# Altium project SHIELD2.PrjPCB
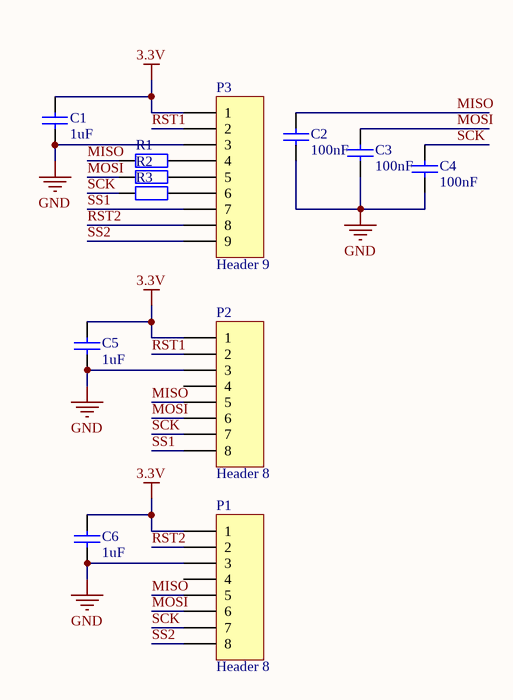
[diagram p0: SHIELD2.SchDoc]
1 sheet, 12 parts. Net scope: global (net labels, ports and power ports of the same name join across sheets).
Board file: PCB2.PcbDoc

## Sheet SHIELD2.SchDoc
size A4

### Parts
C1  value 1uF  [C0805]  (hidden comment: Cap)
C2  value 100nF  [C0805]  (hidden comment: Cap)
C3  value 100nF  [C0805]  (hidden comment: Cap)
C4  value 100nF  [C0805]  (hidden comment: Cap)
C5  value 1uF  [C0805]  (hidden comment: Cap)
C6  value 1uF  [C0805]  (hidden comment: Cap)
P1  Header 8  [HDR1X8]
P2  Header 8  [HDR1X8]
P3  Header 9  [HDR1X9]
R1  Res2  [6-0805_N]  (value not drawn)
R2  Res2  [6-0805_N]  (value not drawn)
R3  Res2  [6-0805_N]  (value not drawn)

### Nets
3.3V: C1.2 C5.2 C6.2 P1.1 P2.1 P3.1
GND: C1.1 C2.1 C3.2 C4.2 C5.1 C6.1 P1.3 P2.3 P3.3
MISO: C2.2 P1.5 P2.5 R1.1
MOSI: C3.1 P1.6 P2.6 R2.1
RST1: P2.2 P3.2
RST2: P1.2 P3.8
SCK: C4.1 P1.7 P2.7 R3.1
SS1: P2.8 P3.7
SS2: P1.8 P3.9
NetP3_4: P3.4 R1.2
NetP3_5: P3.5 R2.2
NetP3_6: P3.6 R3.2

Not connected (* = marked no-connect by the designer): P1 4; P2 4

### Library data of the parts
C1-C6 = Cap: Capacitor; Published: 8-Jun-2000; LatestRevisionDate: 17-Jul-2002; LatestRevisionNote: Re-released for DXP Platform.; PackageReference: RAD-0.3; Publisher: Altium Limited; PackageDescription: Radial Cap, Thru-Hole; 2 Leads; 0.3 in Pin Spacing
P1 P2 = Header 8: Header, 8-Pin; LatestRevisionDate: 17-Jul-2002; LatestRevisionNote: Re-released for DXP Platform.; Publisher: Altium Limited
P3 = Header 9: Header, 9-Pin; LatestRevisionDate: 17-Jul-2002; LatestRevisionNote: Re-released for DXP Platform.; Publisher: Altium Limited
R1-R3 = Res2: Resistor; Value: 1K; Published: 8-Jun-2000; LatestRevisionDate: 17-Jul-2002; LatestRevisionNote: Re-released for DXP Platform.; PackageReference: AXIAL-0.4; Publisher: Altium Limited; PackageDescription: Axial Device, Thru-Hole; 2 Leads; 0.4 in Pin Spacing